# EAGLE design ARTEMIS-mega (EAGLE 5.06)
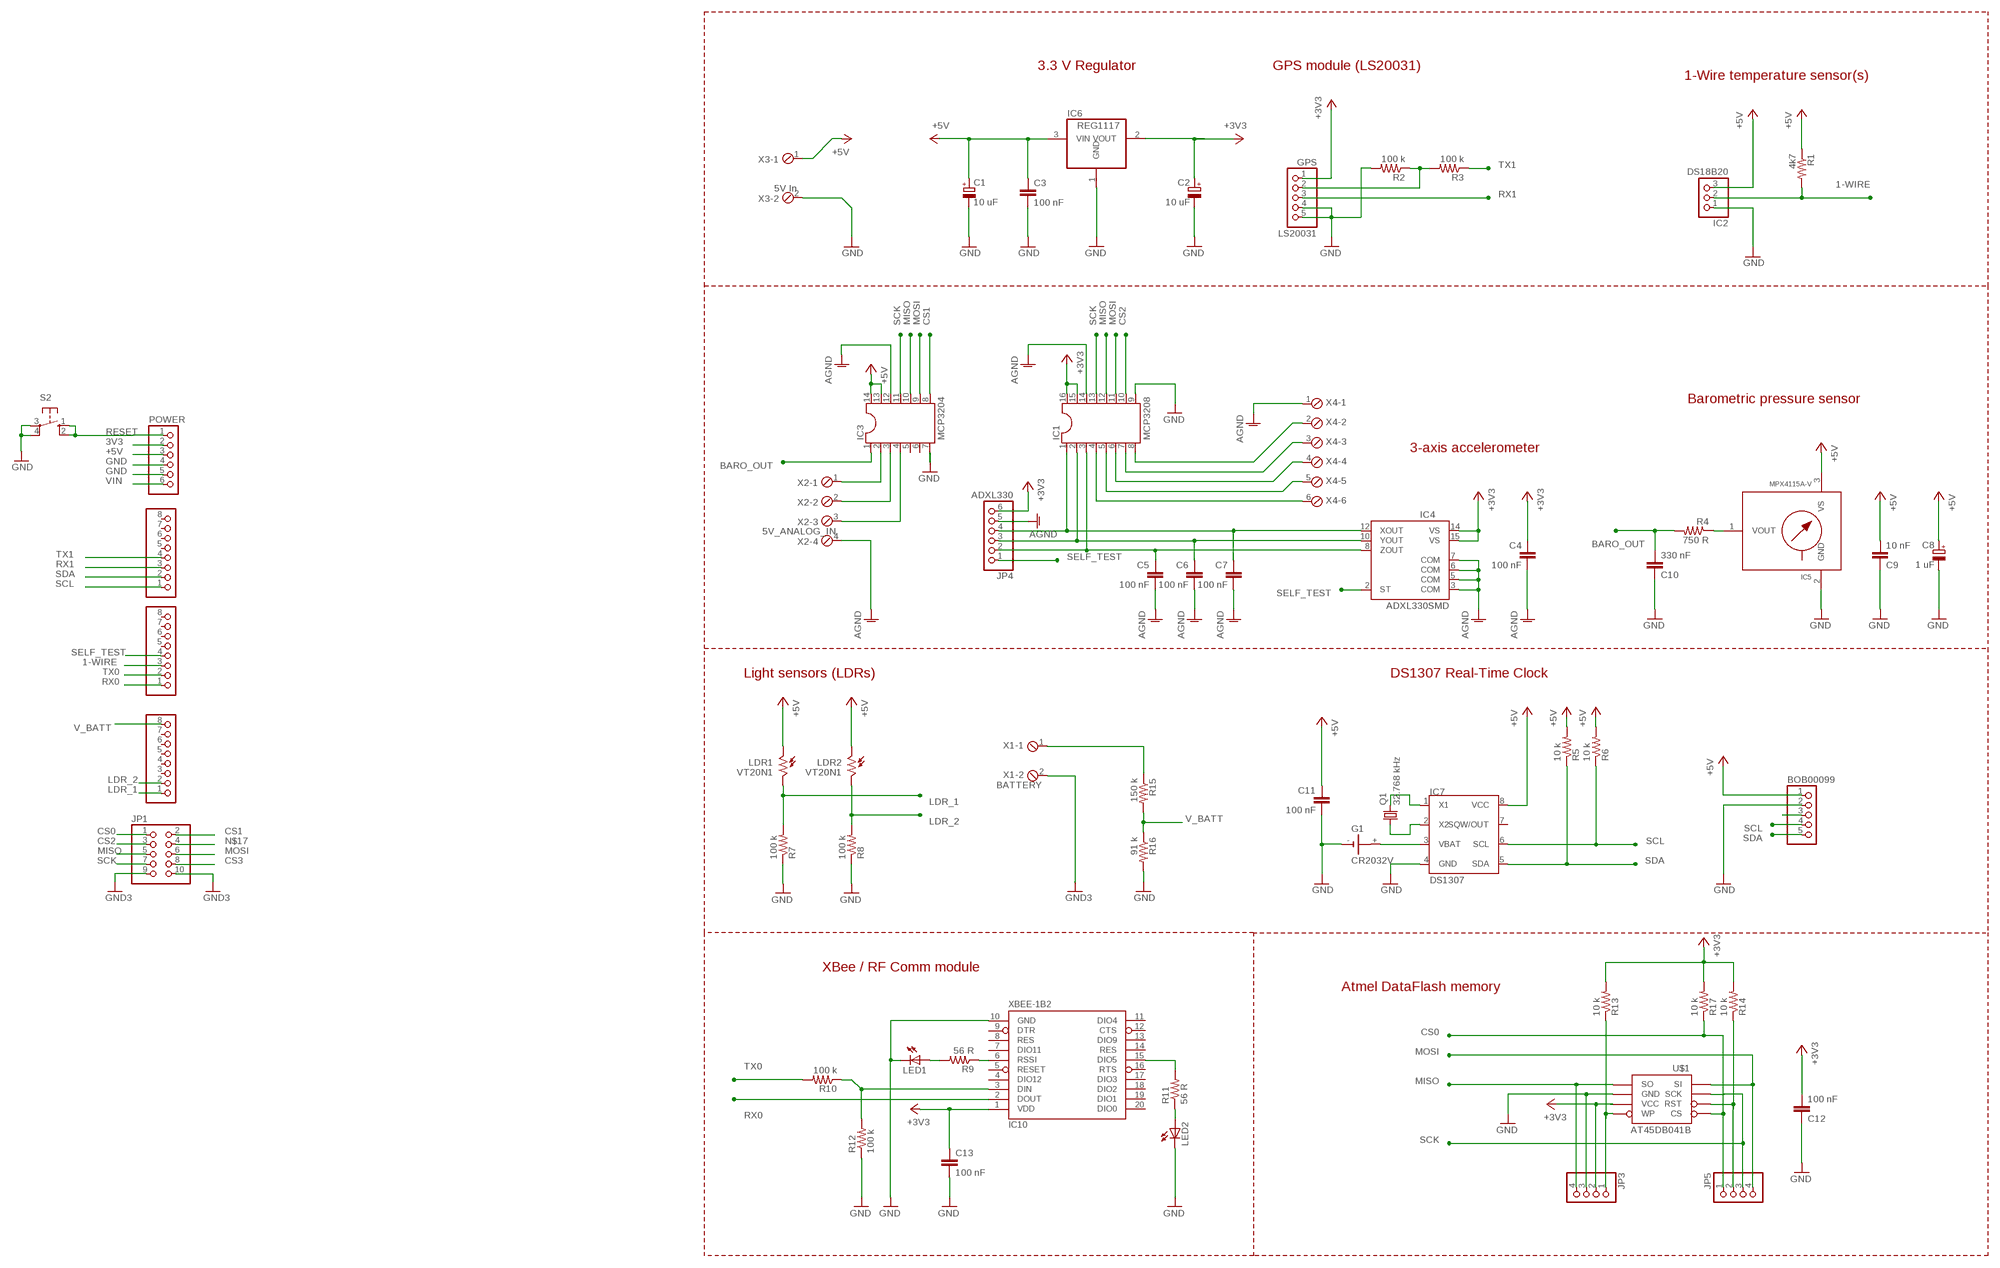
[diagram p0: schematic, sheet 1]

## Parts
ADCL  PINHD-1X8  [1X08]
BOB00099  PINHD-1X5  [1X05]
C1  10 uF  CPOL-EUE5-5  [E5-5]
C2  10 uF  CPOL-EUE5-5  [E5-5]
C3  100 nF  CAP0805  [0805]
C4  100 nF  CAP0805  [0805]
C5  100 nF  CAP0805  [0805]
C6  100 nF  CAP0805  [0805]
C7  100 nF  CAP0805  [0805]
C8  1 uF  CPOL-EUE5-5  [E5-5]
C9  10 nF  CAP0805  [0805]
C10  330 nF  CAP0805  [0805]
C11  100 nF  CAP0805  [0805]
C12  100 nF  CAP0805  [0805]
C13  100 nF  CAP0805  [0805]
COMMUNICATION  PINHD-1X8  [1X08]
G1  CR2032V  [CR2032V]
GPS  LS20031  PINHD-1X5  [1X05]
IC1  MCP3208  DIL16  [DIL16]
IC2  DS18B20  PINHD-1X3  [1X03]
IC3  MCP3204  DIL14  [DIL14]
IC4  ADXL330SMD  [LFCSP-16]
IC5  MPX4115A-V  [867-V]
IC6  REG1117  [SOT223]
IC7  DS1307  [SOIC-8]
IC10  XBEE-1B2  [XBEE-SILK]
JP1  PINHD-2X5  [2X05]
JP3  PINHD-1X4  [1X04]
JP4  ADXL330  PINHD-1X6  [1X06]
JP5  PINHD-1X4  [1X04]
LDR1  VT20N1  [TO46-VT200]
LDR2  VT20N1  [TO46-VT200]
LED1  LED3MM  [LED3MM]
LED2  LED3MM  [LED3MM]
POWER  PINHD-1X6  [1X06]
PWML  PINHD-1X8  [1X08]
Q1  32.768 kHz  CRYSTALTC38H  [TC38H]
R1  4k7  RESISTOR  [0805]
R2  100 k  RESISTOR  [0805]
R3  100 k  RESISTOR  [0805]
R4  750 R  RESISTOR  [0805]
R5  10 k  RESISTOR  [0805]
R6  10 k  RESISTOR  [0805]
R7  100 k  RESISTOR  [0805]
R8  100 k  RESISTOR  [0805]
R9  56 R  RESISTOR  [0805]
R10  100 k  RESISTOR  [0805]
R11  56 R  RESISTOR  [0805]
R12  100 k  RESISTOR  [0805]
R13  10 k  RESISTOR  [0805]
R14  10 k  RESISTOR  [0805]
R15  150 k  RESISTOR  [0805]
R16  91 k  RESISTOR  [0805]
R17  10 k  RESISTOR  [0805]
S2  10-XX  [B3F-10XX]
U$1  AT45DB041B  [SO08]
X1  BATTERY  MPT2  [2POL254]
X2  5V_ANALOG_IN  MPT4  [4POL254]
X3  5V In  MPT2  [2POL254]
X4  MPT6  [6POL254]

## Nets
1-WIRE: IC2.2 PWML.3 R1.2
3V3: POWER.2
+3V3: C2.+ C4.1 C12.2 C13.1 GPS.1 IC1.15 IC1.16 IC4.14(VS) IC4.15(VS) IC6.2(VOUT) IC10.1(VDD) JP3.2 JP4.6 R13.2 R14.2 R17.2 U$1.6(VCC)
+5V: BOB00099.1 C1.+ C3.1 C8.+ C9.2 C11.1 IC2.3 IC3.13 IC3.14 IC5.3(VS) IC6.3(VIN) IC7.8(VCC) LDR1.1 LDR2.1 POWER.3 R1.1 R5.2 R6.2 X3.1
AGND [gnd]: C4.2 C5.2 C6.2 C7.2 IC1.14 IC3.12 IC4.3(COM) IC4.5(COM) IC4.6(COM) IC4.7(COM) JP4.5 X2.4 X4.1
ANALOG_IN: IC1.4 X4.6
BARO_OUT: C10.2 IC3.1 R4.2
CS0: JP1.1 JP5.1 R17.1 U$1.4(CS)
CS1: IC3.8 JP1.2
CS2: IC1.10 JP1.3
CS3: JP1.8
GND: BOB00099.2 C1.- C2.- C3.2 C8.- C9.1 C10.1 C11.2 C12.1 C13.2 G1.- GPS.4 GPS.5 IC1.9 IC2.1 IC3.7 IC5.2(GND) IC6.1(GND) IC7.4(GND) IC10.10(GND) JP1.9 JP1.10 JP3.3 LED1.K(C) LED2.K(C) POWER.4 POWER.5 R2.2 R7.1 R8.1 R12.1 R16.2 S2.3(P) S2.4(P1) U$1.7(GND) X1.2 X3.2 ; supply symbol labelled GND3
LDR_1: ADCL.1 LDR1.2 R7.2
LDR_2: ADCL.2 LDR2.2 R8.2
MISO: IC1.12 IC3.10 JP1.5 JP3.4 U$1.8(SO)
MOSI: IC1.11 IC3.9 JP1.6 JP5.4 U$1.1(SI)
N$2: G1.+ IC7.3(VBAT)
N$3: IC7.2(X2) Q1.1
N$4: IC1.8 X4.2
N$5: R15.1 X1.1
N$7: JP5.2 R14.1 U$1.3(RST)
N$9: IC1.7 X4.3
N$10: IC1.6 X4.4
N$11: GPS.2 R2.1 R3.2
N$12: IC5.1(VOUT) R4.1
N$13: IC1.5 X4.5
N$15: IC3.2 X2.1
N$16: JP3.1 R13.1 U$1.5(WP)
N$17: JP1.4
N$18: IC3.3 X2.2
N$19: IC3.4 X2.3
N$20: IC7.1(X1) Q1.2
N$23: IC10.3(DIN) R10.1 R12.2
N$25: BOB00099.3
N$31: IC10.6(RSSI) R9.1
N$32: LED1.A R9.2
N$33: IC10.15(DIO5) R11.2
N$34: LED2.A R11.1
RESET: POWER.1 S2.1(S) S2.2(S1)
RX0: IC10.2(DOUT) PWML.1
RX1: COMMUNICATION.3 GPS.3
SCK: IC1.13 IC3.11 JP1.7 JP5.3 U$1.2(SCK)
SCL: BOB00099.4 COMMUNICATION.1 IC7.6(SCL) R6.1
SDA: BOB00099.5 COMMUNICATION.2 IC7.5(SDA) R5.1
SELF_TEST: IC4.2(ST) JP4.1 PWML.4
TX0: PWML.2 R10.2
TX1: COMMUNICATION.4 R3.1
V_BATT: ADCL.8 R15.2 R16.1
VIN: POWER.6
X_OUT: C7.1 IC1.1 IC4.12(XOUT) JP4.4
Y_OUT: C6.1 IC1.2 IC4.10(YOUT) JP4.3
Z_OUT: C5.1 IC1.3 IC4.8(ZOUT) JP4.2
Unconnected: ADCL.3 ADCL.4 ADCL.5 ADCL.6 ADCL.7 COMMUNICATION.5 COMMUNICATION.6 COMMUNICATION.7 COMMUNICATION.8 G1.+@1(+) IC3.5 IC3.6 IC5.4(NC) IC5.5(NC) IC5.6(NC) IC7.7(SQW/OUT) IC10.4(DIO12) IC10.5(RESET) IC10.7(DIO11) IC10.8(RES) IC10.9(DTR) IC10.11(DIO4) IC10.12(CTS) IC10.13(DIO9) IC10.14(RES) IC10.16(RTS) IC10.17(DIO3) IC10.18(DIO2) IC10.19(DIO1) IC10.20(DIO0) PWML.5 PWML.6 PWML.7 PWML.8

## Notes on the sheet
- 3.3 V Regulator | GPS module (LS20031)
- 1-Wire temperature sensor(s)
- Barometric pressure sensor
- 3-axis accelerometer
- Light sensors (LDRs) | DS1307 Real-Time Clock
- XBee / RF Comm module
- Atmel DataFlash memory

## Library data of the parts
ADCL COMMUNICATION PWML = pinhead:PINHD-1X8: PIN HEADER
BOB00099 GPS = pinhead:PINHD-1X5: PIN HEADER
C1 C2 C8 = rcl:CPOL-EU: POLARIZED CAPACITOR, European symbol
C3-C7 C9-C13 = SparkFun:CAP: Capacitor Standard 0603 ceramic capacitor, and 0.1" leaded capacitor.
G1 = battery:CR2032V: LI BATTERY Varta
IC1 = ic-package:DIL16: Dual In Line / Socket
IC2 = pinhead:PINHD-1X3: PIN HEADER
IC3 = ic-package:DIL14: Dual In Line / Socket
IC4 = SparkFun:ADXL330: Triple Axis Accelerometer Analog Devices ADXL330 +/-3g 2.4V-5.25V Analog output. Spark Fun Electronics SKU : COM-00730. Center pad paste layer has been reduced to avoid shorting.
IC5 = mpx-freescale:MPX4115A: Integrated Silicon Pressure Sensor for Manifold Absolute Pressure, Altimeter or Barometer Applications On-Chip Signal Conditioned, Temperature Compensated and Calibrated INTEGRATED PRESSURE SENSOR 15 to 115 kPa (2.2 to 16.7 psi) 0.2 to 4.8 Volts Output
IC6 = burr-brown:REG1117: 800mA and 1A Low Dropout (LDO) Positive Regulator 1.8V, 2.5V, 2.85V, 3.3V, 5V, and Adj
IC7 = dallas-1:DS1307: I2C Serial RTC w/56 bytes battery backed RAM
IC10 = SparkFun:XBEE-1
JP1 = pinhead:PINHD-2X5: PIN HEADER
JP3 JP5 = pinhead:PINHD-1X4: PIN HEADER
JP4 POWER = pinhead:PINHD-1X6: PIN HEADER
LDR1 LDR2 = photo-elements:VT2*: Photoconductive Cell VT200 Series Source: http://optoelectronics.perkinelmer.com/content/Datasheets/DTS_vt200seriesdatasheet.pdf
LED1 LED2 = led:LED: LED OSRAM: - CHIPLED LG R971, LG N971, LY N971, LG Q971, LY Q971, LO R971, LY R971 LH N974, LH R974 LS Q976, LO Q976, LY Q976 LO Q996 - Hyper CHIPLED LW Q18S LB Q993, LB Q99A, LB R99A - SideLED LS A670, LO A670, LY A670, LG A670, LP A670 LB A673, LV A673, LT A673, LW A673 LH A674 LY A675 LS A676, LA A676, LO A676, LY A676, LW A676 LS A679, LY A679, LG A679 - Hyper Micro SIDELED® LS Y876, LA Y876, LO Y876, LY Y876 LT Y87S - SmartLED LW L88C, LW L88S LB L89C, LB L89S, LG L890 LS L89K, LO L89K, LY L89K LS L896, LA L896, LO L896, LY L896 - TOPLED LS T670, LO T670, LY T670, LG T670, LP T670 LSG T670, LSP T670, LSY T670, LOP T670, LYG T670 LG T671, LOG T671, LSG T671 LB T673, LV T673, LT T673, LW T673 LH T674 LS T676, LA T676, LO T676, LY T676, LB T676, LH T676, LSB T676, LW T676 LB T67C, LV T67C, LT T67C, LS T67K, LO T67K, LY T67K, LW E67C LS E67B, LA E67B, LO E67B, LY E67B, LB E67C, LV E67C, LT E67C LW T67C LS T679, LY T679, LG T679 LS T770, LO T770, LY T770, LG T770, LP T770 LB T773, LV T773, LT T773, LW T773 LH T774 LS E675, LA E675, LY E675, LS T675 LS T776, LA T776, LO T776, LY T776, LB T776 LHGB T686 LT T68C, LB T68C - Hyper Mini TOPLED® LB M676 - Mini TOPLED Santana® LG M470 LS M47K, LO M47K, LY M47K Source: http://www.osram.convergy.de LUXEON: - LUMILED® LXK2-PW12-R00, LXK2-PW12-S00, LXK2-PW14-U00, LXK2-PW14-V00 LXK2-PM12-R00, LXK2-PM12-S00, LXK2-PM14-U00 LXK2-PE12-Q00, LXK2-PE12-R00, LXK2-PE12-S00, LXK2-PE14-T00, LXK2-PE14-U00 LXK2-PB12-K00, LXK2-PB12-L00, LXK2-PB12-M00, LXK2-PB14-N00, LXK2-PB14-P00, LXK2-PB14-Q00 LXK2-PR12-L00, LXK2-PR12-M00, LXK2-PR14-Q00, LXK2-PR14-R00 LXK2-PD12-Q00, LXK2-PD12-R00, LXK2-PD12-S00 LXK2-PH12-R00, LXK2-PH12-S00 LXK2-PL12-P00, LXK2-PL12-Q00, LXK2-PL12-R00 Source: www.luxeon.com KINGBRIGHT: KA-3528ASYC Source: www.kingbright.com
Q1 = SparkFun:CRYSTAL: Crystals Various standard crystals. Proven footprints. Spark Fun Electronics SKU : COM-00534
R1-R17 = SparkFun:RESISTOR: Resistor Basic schematic elements and footprints for 0603, 1206, and PTH 1/10th watt (small) resistors.
S2 = switch-omron:10-XX: OMRON SWITCH
U$1 = SparkFun:AT45DB041B
X1 X3 = con-phoenix-254:MPT2: PHOENIX CONNECTOR
X2 = con-phoenix-254:MPT4: PHOENIX CONNECTOR
X4 = con-phoenix-254:MPT6: PHOENIX CONNECTOR

## Net classes
1 power: width 0.61 mm, drill 0.711 mm, clearance 0.203 mm
2 gnd: width 0.305 mm, drill 0.711 mm, clearance 0.203 mm
3 usbvcc: width 0.508 mm, drill 0.711 mm, clearance 0.203 mm

## Board
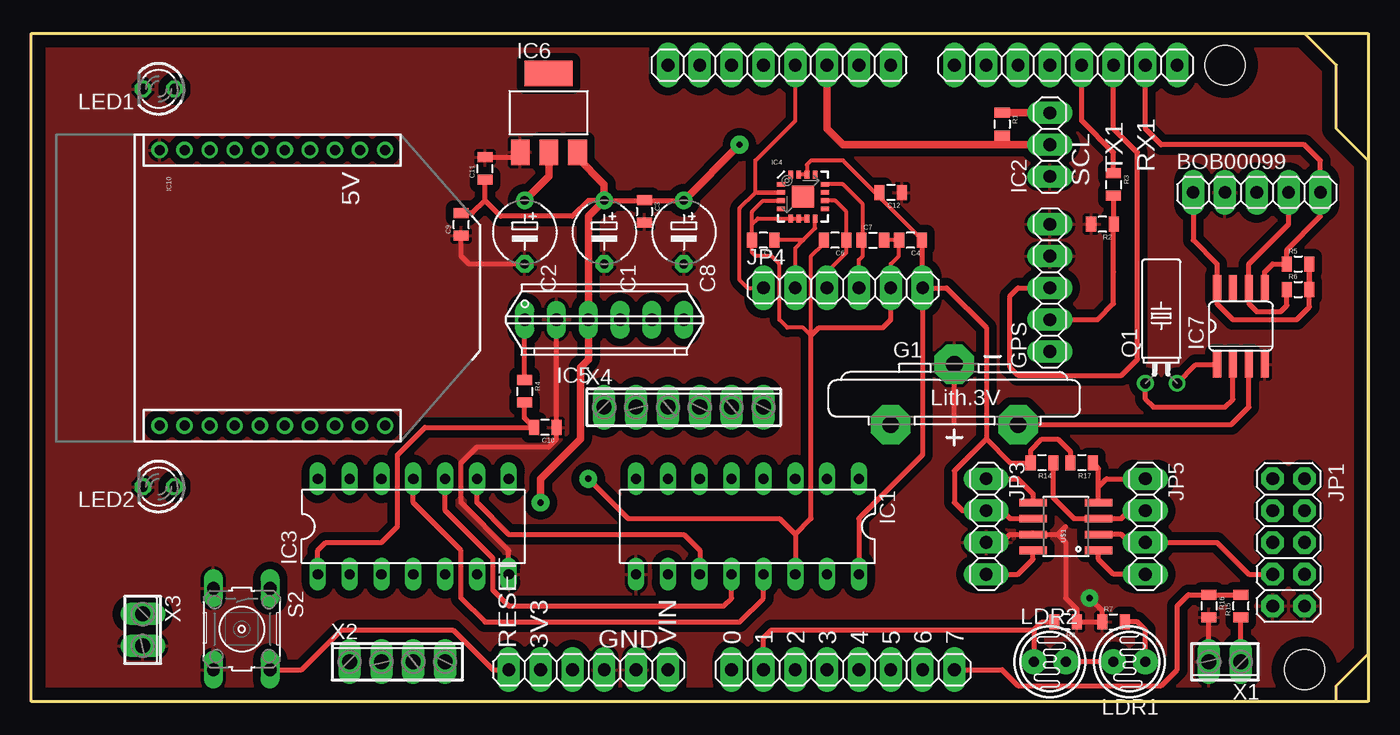
[diagram p1: board, top side]
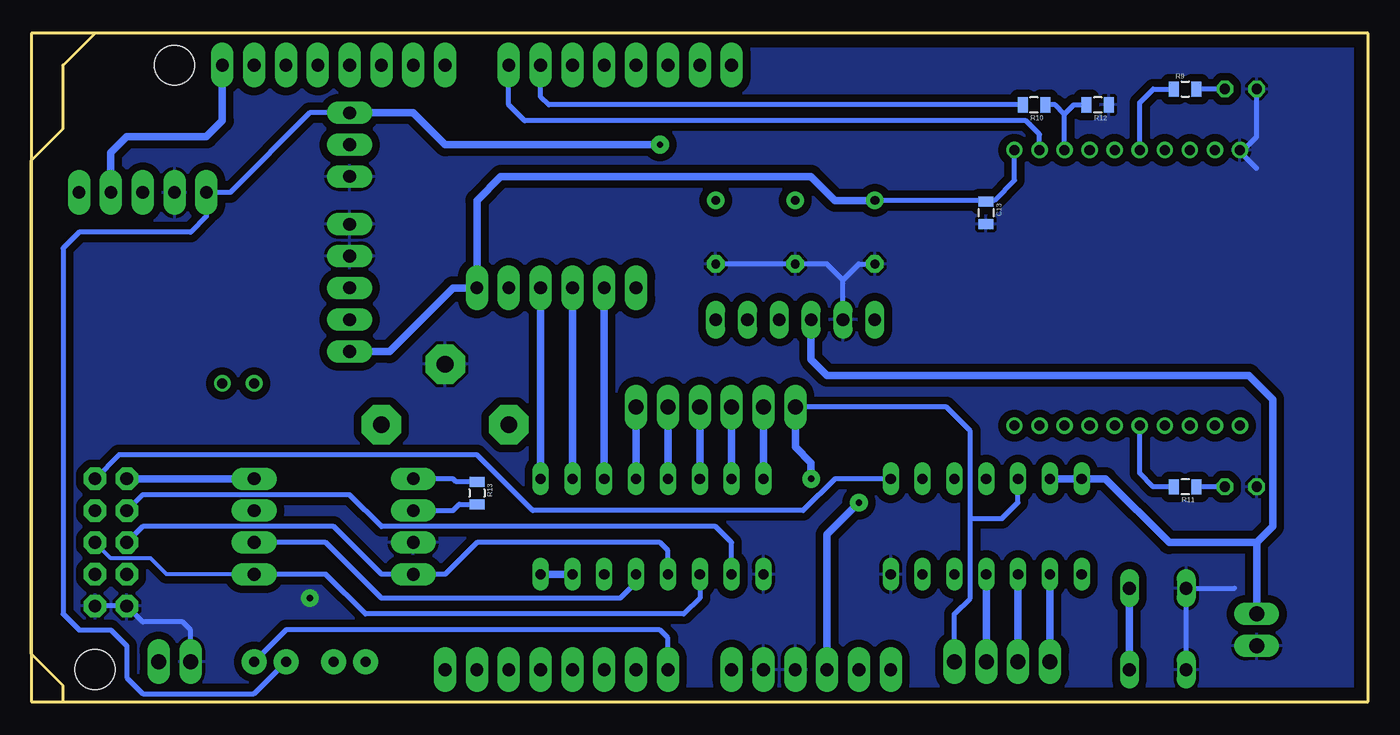
[diagram p2: board, bottom side, seen from below]

Size 106.68 x 53.34 mm. Coordinates in mm from the lower left corner, seen from the top.
Outline: 101.6,53.34 0,53.34 0,0 104.14,0
Outline: 104.14,0 104.14,1.27 106.68,3.81 106.68,43.18 104.14,45.72 104.14,50.8 101.6,53.34
Outline: 101.6,53.34 106.68,53.34 106.68,0 104.14,0
Copper layers (1*16): Top 0.035mm / dielectric 1.5mm / Bottom 0.035mm
Design rules "default *": minimum track width 8mil, minimum drill 16mil, track to track 8mil, track to pad 8mil, pad to pad 8mil, via to via 10mil, smd to smd 8mil, copper to edge 40mil, drill to drill 12mil, minimum pad ring 10mil, minimum via ring 10mil, stop-mask expansion 4mil, vias tented up to drill 0mil, thermal gap 10mil
Holes 3.2 mm at 101.6,2.54 95.25,50.8

### Footprints (pad centres in the part's own frame; a part is rotated, then mirrored left to right if it is on the bottom)
1X08 = drill 1.016 pad 1.8 long: 1 -8.89,0; 2 -6.35,0; 3 -3.81,0; 4 -1.27,0; 5 1.27,0; 6 3.81,0; 7 6.35,0; 8 8.89,0
1X05 = drill 1.016 pad 1.8 long: 1 -5.08,0; 2 -2.54,0; 3 0,0; 4 2.54,0; 5 5.08,0
E5-5 = drill 0.7 pad 1.4 round: + -2.54,0 | drill 0.7 pad 1.4 octagon: - 2.54,0
0805 = smd 0.8 x 1.2: 1 -0.9,0; 2 0.9,0
CR2032V = drill 1.321 pad 3.15 octagon: + -2.54,-5.08; +@1 -2.54,5.08; - 2.286,0
DIL16 = drill 0.813 long: 1 -8.89,-3.81; 2 -6.35,-3.81; 3 -3.81,-3.81; 4 -1.27,-3.81; 5 1.27,-3.81; 6 3.81,-3.81; 7 6.35,-3.81; 8 8.89,-3.81; 9 8.89,3.81; 10 6.35,3.81; 11 3.81,3.81; 12 1.27,3.81; 13 -1.27,3.81; 14 -3.81,3.81; 15 -6.35,3.81; 16 -8.89,3.81
1X03 = drill 1.016 pad 1.8 long: 1 -2.54,0; 2 0,0; 3 2.54,0
DIL14 = drill 0.813 long: 1 -7.62,-3.81; 2 -5.08,-3.81; 3 -2.54,-3.81; 4 0,-3.81; 5 2.54,-3.81; 6 5.08,-3.81; 7 7.62,-3.81; 8 7.62,3.81; 9 5.08,3.81; 10 2.54,3.81; 11 0,3.81; 12 -2.54,3.81; 13 -5.08,3.81; 14 -7.62,3.81
LFCSP-16 = smd 1.75 x 1.75: 0 0,0 | smd 0.65 x 0.37: 1 -1.75,0.975; 2 -1.75,0.325; 3 -1.75,-0.325; 4 -1.75,-0.975; 9 1.75,-0.975; 10 1.75,-0.325; 11 1.75,0.325; 12 1.75,0.975 | smd 0.37 x 0.65: 5 -0.975,-1.75; 6 -0.325,-1.75; 7 0.325,-1.75; 8 0.975,-1.75; 13 0.975,1.75; 14 0.325,1.75; 15 -0.325,1.75; 16 -0.975,1.75
867-V = drill 1.016 long: 1 -6.35,0; 2 -3.81,0; 3 -1.27,0; 4 1.27,0; 5 3.81,0; 6 6.35,0
SOT223 = smd 1.499 x 2.007: 1 -2.261,-3.15; 2 0.025,-3.15; 3 2.311,-3.15 | smd 3.81 x 2.007: 4 0,3.15
SOIC-8 = smd 2.032 x 0.66: 1 -3.073,1.27; 2 -3.073,0; 3 -3.073,-1.27; 4 -3.073,-2.54; 5 3.073,-2.54; 6 3.073,-1.27; 7 3.073,0; 8 3.073,1.27
XBEE-SILK = drill 0.8 round: 1 -11,20; 2 -11,18; 3 -11,16; 4 -11,14; 5 -11,12; 6 -11,10; 7 -11,8; 8 -11,6; 9 -11,4; 10 -11,2; 11 11,2; 12 11,4; 13 11,6; 14 11,8; 15 11,10; 16 11,12; 17 11,14; 18 11,16; 19 11,18; 20 11,20
2X05 = drill 1.016 pad 1.8 octagon: 1 -5.08,-1.27; 2 -5.08,1.27; 3 -2.54,-1.27; 4 -2.54,1.27; 5 0,-1.27; 6 0,1.27; 7 2.54,-1.27; 8 2.54,1.27; 9 5.08,-1.27; 10 5.08,1.27
1X04 = drill 1.016 pad 1.8 long: 1 -3.81,0; 2 -1.27,0; 3 1.27,0; 4 3.81,0
1X06 = drill 1.016 pad 1.8 long: 1 -6.35,0; 2 -3.81,0; 3 -1.27,0; 4 1.27,0; 5 3.81,0; 6 6.35,0
TO46-VT200 = drill 0.8 pad 2 round: 1 -1.27,0; 2 1.27,0
LED3MM = drill 0.813 octagon: A -1.27,0; K 1.27,0
TC38H = drill 0.813 round: 1 -1.27,0; 2 1.27,0
B3F-10XX = drill 1.016 long: 1 -3.251,2.261; 2 3.251,2.261; 3 -3.251,-2.261; 4 3.251,-2.261
SO08 = smd 0.61 x 2.21: 1 -1.905,-2.616; 2 -0.635,-2.616; 3 0.635,-2.616; 4 1.905,-2.616; 5 1.905,2.616; 6 0.635,2.616; 7 -0.635,2.616; 8 -1.905,2.616
2POL254 = drill 1.2 long: 1 -1.27,0; 2 1.27,0
4POL254 = drill 1.2 long: 1 -3.81,0; 2 -1.27,0; 3 1.27,0; 4 3.81,0
6POL254 = drill 1.2 pad 1.778 long: 1 -6.35,0; 2 -3.81,0; 3 -1.27,0; 4 1.27,0; 5 3.81,0; 6 6.35,0

### Placement (x,y rotation side)
ADCL  64.77,2.54 0 top
BOB00099  97.79,40.64 0 top
C1  45.72,37.47 270 top
C2  39.37,37.47 270 top
C3  48.92,39.12 270 top
C4  70.15,36.83 180 top
C5  58.42,36.83 180 top
C6  64.13,36.83 180 top
C7  67.16,36.83 0 top
C8  52.07,37.47 270 top
C9  34.3,38.09 90 top
C10  41.01,21.88 180 top
C11  36.2,42.55 90 top
C12  68.58,40.64 180 top
C13  30.49,39.01 270 bottom
COMMUNICATION  82.55,50.8 180 top
G1  73.66,24.64 90 top
GPS  81.28,33.02 90 top
IC1  57.15,13.97 180 top
IC2  81.28,44.45 90 top
IC3  30.48,13.97 0 top
IC4  61.57,40.31 0 top
IC5  45.72,30.48 0 top
IC6  41.27,46.99 0 top
IC7  95.89,29.97 90 top
IC10  8.23,33.02 270 top
JP1  100.33,12.7 270 top
JP3  76.2,13.97 270 top
JP4  64.77,33.02 0 top
JP5  88.9,13.97 270 top
LDR1  87.63,3.17 0 top
LDR2  81.28,3.17 180 top
LED1  10.16,48.9 180 top
LED2  10.16,17.14 180 top
POWER  44.45,2.54 0 top
PWML  59.69,50.8 180 top
Q1  90.17,25.4 0 top
R1  77.47,46.09 270 top
R2  85.47,38.1 180 top
R3  86.36,41.28 270 top
R4  39.37,24.77 270 top
R5  101.09,34.93 0 top
R6  101.09,32.89 0 top
R7  86.36,6.35 0 top
R8  82.55,6.35 180 top
R9  14.61,48.9 0 bottom
R10  26.67,47.62 180 bottom
R11  14.61,17.14 180 bottom
R12  21.59,47.62 180 bottom
R13  71.12,16.64 270 bottom
R14  80.64,19.05 180 top
R15  96.52,7.62 90 top
R16  93.98,7.62 270 top
R17  83.82,19.05 180 top
S2  16.79,5.79 270 top
U$1  82.55,13.97 90 top
X1  95.25,3.17 180 top
X2  29.21,3.17 0 top
X3  8.89,5.71 270 top
X4  52.07,23.5 0 top

### Tracks (layer width: path | path; a pad name or v marks a point on that pad's centre or on a via)
1-WIRE
  Top 0.61: 77.47,44.45 64.77,44.45 63.5,45.72 PWML.3 | 77.47,44.45 IC2.2 | 77.47,44.45 R1.2
+3V3
  Top 0.305: IC4.15 IC4.14 61.9,42.85 62.23,43.18 64.77,43.18 67.31,40.64 | 71.12,36.83 67.31,40.64 | 67.31,40.64 C12.2
  Top 0.406: U$1.6 78.11,14.61 77.47,15.24 | 77.47,15.24 JP3.2 | IC1.16 66.04,14.61 71.12,19.68 JP4.6 | JP4.6 71.12,36.83 C4.1 | R17.2 82.92,19.95 81.92,20.95 80.64,20.95 79.75,20.05 R14.2 78.11,19.05 76.2,20.95 | 76.2,20.95 76.2,29.84 73.03,33.02 JP4.6 | 77.47,15.24 74.3,15.24 73.66,15.88 73.66,18.41 76.2,20.95
  Top 0.61: IC6.2 41.3,41.94 C2.+
  Bottom 0.406: IC10.1 28.23,41.62 29.84,40.01 | 29.84,40.01 C2.+ | 29.84,40.01 30.4,40.01 C13.1 | R13.2 72.53,15.74 73.03,15.24 JP3.2
  Bottom 0.61: GPS.1 78.11,27.94 73.03,33.02 JP4.6 71.12,40.01 69.22,41.91 44.45,41.91 42.55,40.01 C2.+ | IC1.16 IC1.15
+5V  (via drill 0.5 pad 1.42)
  Top 0.406: LDR1.1 LDR2.1 | BOB00099.1 92.71,36.83 94.61,34.93 IC7.8 94.61,31.75 95.89,30.48 100.97,30.48 101.99,31.51 R5.2 R6.2 | 36.2,40.01 C11.1 | 36.2,40.01 37.47,38.74 43.18,38.74 44.45,40.01 C1.+ 48.9,40.01 | C9.2 35.18,38.99 36.2,40.01 | 48.9,40.01 C3.1 | 48.9,40.01 C8.+
  Top 0.61: IC6.3 43.59,43.41 45.72,41.28 C1.+ 44.45,38.74 IC5.3 44.45,27.3 43.81,26.67 43.81,20.95 40.64,17.78 v40.64,15.88 | C8.+ v56.52,44.45 | R1.1 IC2.3
  Bottom 0.406: LDR1.1 88.9,0.64 97.79,0.64 99.06,1.91 99.06,4.45 100.33,5.71 102.87,5.71 104.14,6.98 104.14,36.2 102.87,37.47 93.98,37.47 92.71,38.74 BOB00099.1 90.81,40.64 84.45,46.99 IC2.3
  Bottom 0.61: X3.1 8.89,12.7 | 8.89,12.7 7.62,13.97 7.62,24.13 9.53,26.04 43.18,26.04 44.45,27.3 IC5.3 | 8.89,12.7 15.88,12.7 20.95,17.78 IC3.14 IC3.13 | POWER.3 43.18,13.33 v40.64,15.88 | v56.52,44.45 73.66,44.45 76.2,46.99 IC2.3
AGND  (via drill 0.5 pad 1.42)
  Top 0.305: IC4.7 IC4.6 IC4.5 57.98,38.56 57.52,38.1 | 57.52,38.1 57.52,39.11 58.4,39.99 IC4.3 | JP4.5 68.58,34.93 69.22,35.56 | C6.2 63.23,36.57 62.23,35.56 62.23,29.21 61.59,29.84 60.33,29.84 59.69,30.48 59.69,34.93 59.05,35.56 57.79,35.56 57.52,35.83 C5.2 57.52,38.1 | 69.22,36.83 C4.2 69.22,36.79 69.22,35.56 | 69.22,36.83 C7.2 | 69.22,35.56 69.22,36.83
  Top 0.406: 60.96,13.33 59.69,14.61 47.62,14.61 v44.45,17.78 | 60.96,13.33 IC1.14 | JP4.5 68.58,30.48 67.94,29.84 62.87,29.84 62.23,29.21 62.23,14.61 60.96,13.33
  Bottom 0.406: IC3.12 27.94,15.88 29.21,14.61 31.75,14.61 | 31.75,14.61 31.75,8.26 33.02,6.98 X2.4 | 31.75,14.61 31.75,21.59 33.66,23.5 X4.1
  Bottom 0.61: v44.45,17.78 44.45,19.05 45.72,20.32 X4.1
ANALOG_IN
  Bottom 0.61: IC1.4 X4.6
BARO_OUT
  Top 0.406: R4.2 39.36,23.85 39.36,22.63 C10.2 31.41,21.88 29.21,19.68 29.21,13.97 27.94,12.7 23.5,12.7 22.86,12.06 IC3.1
CS0
  Top 0.406: 84.72,18.79 R17.1 85.17,18.6 85.17,17.14 | U$1.4 85.17,17.14 | JP5.1 85.8,17.78 85.17,17.14
  Bottom 0.61: JP5.1 JP1.1
CS1
  Bottom 0.406: JP1.2 99.7,19.68 71.12,19.68 66.67,15.24 45.09,15.24 42.55,17.78 IC3.8
CS2
  Bottom 0.406: JP1.3 97.79,16.51 81.28,16.51 78.74,13.97 52.07,13.97 50.8,12.7 IC1.10
GND  (via drill 0.5 pad 1.42)
  Top 0.406: 81.92,13.33 U$1.7 78.11,13.33 77.47,12.7 JP3.3 | 81.92,13.33 82.55,12.7 82.55,8.26 83.45,7.36 R8.1 R7.1 85.46,7.25 v84.45,8.26 | IC3.7 38.1,12.06 34.29,15.88 34.29,19.05 35.56,20.32 41.27,20.32 41.91,20.95 C10.1 IC5.2 | 73.66,22.22 G1.- | 81.92,13.33 82.55,13.97 | C11.2 38.62,43.45 IC6.1 | C2.- 34.92,34.93 34.3,35.55 C9.1 | X1.2 R16.2
  Bottom 0.406: S2.4 S2.3 10.64,9.04 | 8.89,42.55 10.23,43.89 IC10.10 9.96,44.02 8.89,45.09 LED1.K | G1.- 73.66,27.94 | 41.91,33.66 40.64,34.93 C2.- | IC5.2 41.91,33.66 | 41.91,33.66 43.18,34.93 C1.- C8.- | X1.2 93.98,5.71 94.61,6.35 97.79,6.35 JP1.9 JP1.10
  pour Bottom (isolate 0.61): 0,53.34 106.68,53.34 106.68,0 0,0
  pour Top (isolate 0.61): 0,53.34 106.68,53.34 106.68,0 0,0
LDR_1
  Top 0.406: R7.2 88.27,6.35 88.9,5.71 LDR1.2
  Bottom 0.406: ADCL.1 55.88,5.08 56.52,5.71 86.36,5.71 LDR1.2
LDR_2
  Top 0.406: ADCL.2 58.42,5.08 59.05,5.71 80.01,5.71 | R8.2 80.64,6.35 80.01,5.71 | 80.01,5.71 LDR2.2
MISO
  Top 0.406: U$1.8 79.93,11.35 78.74,10.16 JP3.4 | IC3.10 33.02,15.24 36.83,11.43 36.83,8.89 38.1,7.62 55.24,7.62 55.88,8.26 IC1.12
  Bottom 0.406: JP1.5 97.79,13.97 82.55,13.97 78.74,10.16 JP3.4 73.66,10.16 71.12,12.7 56.52,12.7 55.88,12.06 IC1.12
MOSI
  Top 0.406: IC3.9 35.56,15.88 38.1,13.33 52.07,13.33 53.34,12.06 IC1.11 | U$1.1 85.17,11.35 86.36,10.16 JP5.4
  Bottom 0.305: JP1.6 100.33,11.43 97.16,11.43 95.89,10.16 JP5.4
  Bottom 0.406: IC1.11 53.34,8.26 54.61,6.98 80.01,6.98 83.19,10.16 JP5.4
N$2
  Top 0.406: IC7.3 97.16,23.5 95.76,22.1 G1.+
N$3
  Top 0.406: Q1.1 88.9,24.13 89.53,23.5 95.25,23.5 95.89,24.13 IC7.2
N$4
  Bottom 0.61: IC1.8 X4.2
N$5
  Top 0.406: X1.1 R15.1
N$7
  Top 0.406: JP5.2 87.63,15.24 87,14.61 U$1.3 83.19,14.61 81.55,16.25 R14.1
N$9
  Bottom 0.61: IC1.7 X4.3
N$10
  Bottom 0.61: IC1.6 X4.4
N$11
  Top 0.406: R3.2 86.37,40.36 R2.1 86.36,34.29 86.36,31.75 85.09,30.48 GPS.2
N$12
  Top 0.406: R4.1 IC5.1
N$13
  Bottom 0.61: IC1.5 X4.5
N$15
  Bottom 0.61: X2.1 IC3.2
N$16
  Top 0.406: U$1.5 79.93,16.59 78.74,17.78 JP3.1
  Bottom 0.406: R13.1 72.78,17.54 73.03,17.78 JP3.1
N$18
  Bottom 0.61: X2.2 IC3.3
N$19
  Bottom 0.61: X2.3 IC3.4
N$20
  Top 0.406: IC7.1 92.94,26.9 Q1.2
N$23
  Bottom 0.406: IC10.3 24.23,46.89 | 24.23,46.89 23.5,47.62 R12.2 | R10.1 24.96,47.62 24.23,46.89
N$31
  Bottom 0.406: IC10.6 18.23,47.81 17.15,48.9 R9.1
N$32
  Bottom 0.406: LED1.A R9.2
N$33
  Bottom 0.406: IC10.15 18.23,18.23 17.15,17.14 R11.2
N$34
  Bottom 0.406: LED2.A R11.1
RESET
  Top 0.406: S2.2 21.59,2.54 24.77,5.71 33.66,5.71 36.83,2.54 POWER.1
  Bottom 0.61: S2.2 S2.1
RX0
  Bottom 0.406: IC10.2 26.23,45.28 27.3,46.36 67.31,46.36 68.58,47.62 PWML.1
RX1
  Top 0.406: COMMUNICATION.3 86.36,45.72 88.27,43.82 88.27,27.3 87,26.04 78.74,26.04 78.11,26.67 78.11,32.38 78.74,33.02 GPS.3
SCK
  Top 0.406: JP1.7 97.16,10.16 94.61,12.7 JP5.3 87.63,12.7 87,13.33 U$1.2 | IC3.11 30.48,15.88 34.29,12.06 34.29,8.26 36.2,6.35 56.52,6.35 58.42,8.26 IC1.13
  Bottom 0.406: IC1.13 58.42,9.53 59.69,8.26 78.74,8.26 83.19,12.7 JP5.3
SCL
  Top 0.406: BOB00099.4 100.33,38.1 97.16,34.93 IC7.6 97.16,31.75 97.79,31.11 99.7,31.11 100.19,31.61 R6.1
  Bottom 0.61: BOB00099.4 100.33,43.82 99.06,45.09 92.71,45.09 91.44,46.36 COMMUNICATION.1
SDA
  Top 0.406: COMMUNICATION.2 88.9,45.72 90.17,44.45 101.6,44.45 102.87,43.18 BOB00099.5 102.87,38.74 100.19,36.06 R5.1 99.06,34.93 98.42,34.29 IC7.5 98.42,32.38
SELF_TEST
  Top 0.305: JP4.1 57.15,33.02 56.52,33.66 56.52,39.37 57.78,40.64 IC4.2 57.79,40.64 57.79,43.18 60.96,46.36 PWML.4
TX0
  Bottom 0.406: PWML.2 66.04,48.26 65.41,47.62 R10.2
TX1
  Top 0.406: COMMUNICATION.4 83.82,46.36 86.36,43.82 R3.1
V_BATT
  Top 0.406: ADCL.8 77.47,2.54 78.74,1.27 90.17,1.27 91.44,2.54 91.44,7.62 92.34,8.52 R16.1 R15.2
X_OUT
  Top 0.305: IC4.12 64.76,41.29 66.36,39.69 66.36,37.15 66.05,36.84 66.04,36.84 C7.1 66.36,36.73 66.36,35.56 66.04,35.24 JP4.4
  Bottom 0.61: IC1.1 JP4.4
Y_OUT
  Top 0.305: JP4.3 63.5,34.29 65.03,35.83 C6.1 65.03,39.11 64.16,39.99 IC4.10
  Bottom 0.61: IC1.2 JP4.3
Z_OUT
  Top 0.305: IC4.8 62.55,37.78 61.59,36.83 | 61.59,36.83 C5.1 | JP4.2 60.96,36.2 61.59,36.83
  Bottom 0.61: IC1.3 JP4.2

### Text on the board
tPlace: 0 | 1 | 2 | 3 | 4 | 5 | 6 | 7
tNames: TX1 | RX1 | SCL | 5V | RESET | 3V3 | GND | VIN
Document: 7 | 6 | 5 | 4 | 3 | 2 | +5V | TX0 | RX0 | TX1 | RX1 | SDA | SCL | D | GND | GND | ST | Z | Y | X | GND | +3.3V | GND | +5V | GND | SQW | SCL | SDA | Tx | 1 | 6 | Rx | 3.3V | 3.3V ADC | 46 | 47 | This one is NOT the ground | Analog/Digital star ground | 48 | 49 | (Solder this via to the groundplanes) | 50 | 51 | + | 1 | 52 | 53 | GND | 5 V ADC | RESET | +3.3V | +5V | GND | GND | VIN | 0 | 1 | 2 | 3 | 4 | 5 | 6 | 7 | 5V IN | RESET | -